# Altium schematic sheet screw and Hole.SchDoc
size 297 x 209 mm; SheetNumber: 3; SheetTotal: 4
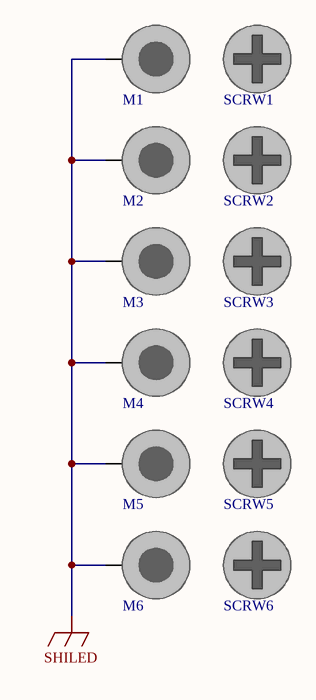
[diagram p0: screw and Hole.SchDoc]

## Parts
M1  DNP/MH  [SCMH_M2]  (value not drawn)  (no BOM)
M2  DNP/MH  [SCMH_M2]  (value not drawn)  (no BOM)
M3  DNP/MH  [SCMH_M2]  (value not drawn)  (no BOM)
M4  DNP/MH  [SCMH_M2]  (value not drawn)  (no BOM)
M5  DNP/MH  [SCMH_M2]  (value not drawn)  (no BOM)
M6  DNP/MH  [SCMH_M2]  (value not drawn)  (no BOM)
SCRW1  SCREW  [SCRW_CHSH_PHLIPS_M2X4]  (value not drawn)
SCRW2  SCREW  [SCRW_CHSH_PHLIPS_M2X4]  (value not drawn)
SCRW3  SCREW  [SCRW_CHSH_PHLIPS_M2X4]  (value not drawn)
SCRW4  SCREW  [SCRW_CHSH_PHLIPS_M2X4]  (value not drawn)
SCRW5  SCREW  [SCRW_CHSH_PHLIPS_M2X4]  (value not drawn)
SCRW6  SCREW  [SCRW_CHSH_PHLIPS_M2X4]  (value not drawn)

## Nets
SHILED: M1.1 M2.1 M3.1 M4.1 M5.1 M6.1

## Notes on the sheet
- Drawn
- Name
- Date
- Drawing Title
- Checked
- Drawing No.
- Approved
- Size
- A4
- Ver.
- Rev.
- Sheet
- Of

## Library data of the parts
M1-M6 = SCMH_M2: SCREW mouting, M2, 2.0mm diameter and 4.0mm PanHead; ASSEMBLY: DNP; VALUE: DNP/MH
SCRW1-SCRW6 = SCRW_CHSH_PHLIPS_M2X4: SCREW, M2, 2.0mm diameter and 4.0mm PanHead; ASSEMBLY: DNP; VALUE: SCREW